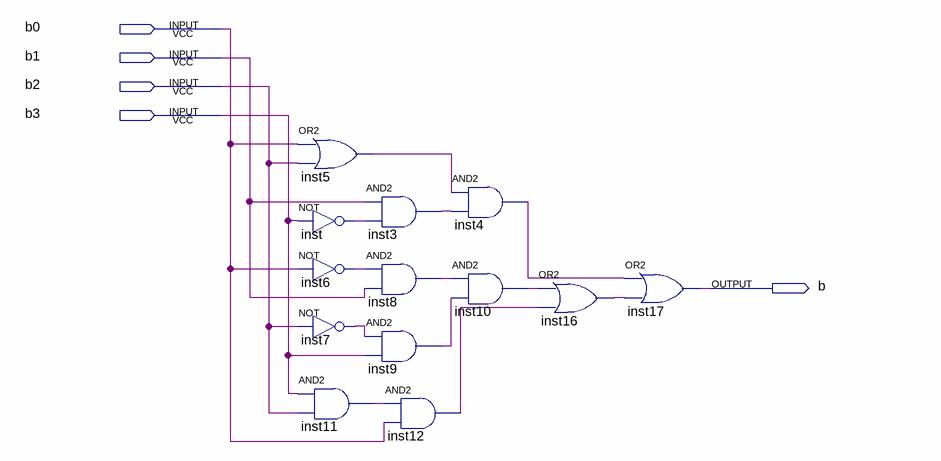
[diagram p0: schematic sheet]
// Quartus schematic b_segment.bdf as structural Verilog: 13 symbols, 5 pins
module b_segment (
  input  b0,
  input  b1,
  input  b2,
  input  b3,
  output b
);

  wire inst3_out, inst4_out, inst5_out, inst6_out, inst7_out, inst8_out, inst9_out, inst10_out, inst11_out,
       inst12_out, inst16_out, inst_out;

  or inst5 (inst5_out, b0, b2);
  not inst (inst_out, b3);
  not inst6 (inst6_out, b0);
  not inst7 (inst7_out, b2);
  and inst11 (inst11_out, b3, b2);
  and inst3 (inst3_out, b1, inst_out);
  and inst8 (inst8_out, inst6_out, b1);
  and inst9 (inst9_out, inst7_out, b3);
  and inst12 (inst12_out, inst11_out, b0);
  and inst4 (inst4_out, inst5_out, inst3_out);
  and inst10 (inst10_out, inst8_out, inst9_out);
  or inst16 (inst16_out, inst10_out, inst12_out);
  or inst17 (b, inst4_out, inst16_out);
endmodule
